# EAGLE design Arduino Nano2 (EAGLE 6.1)
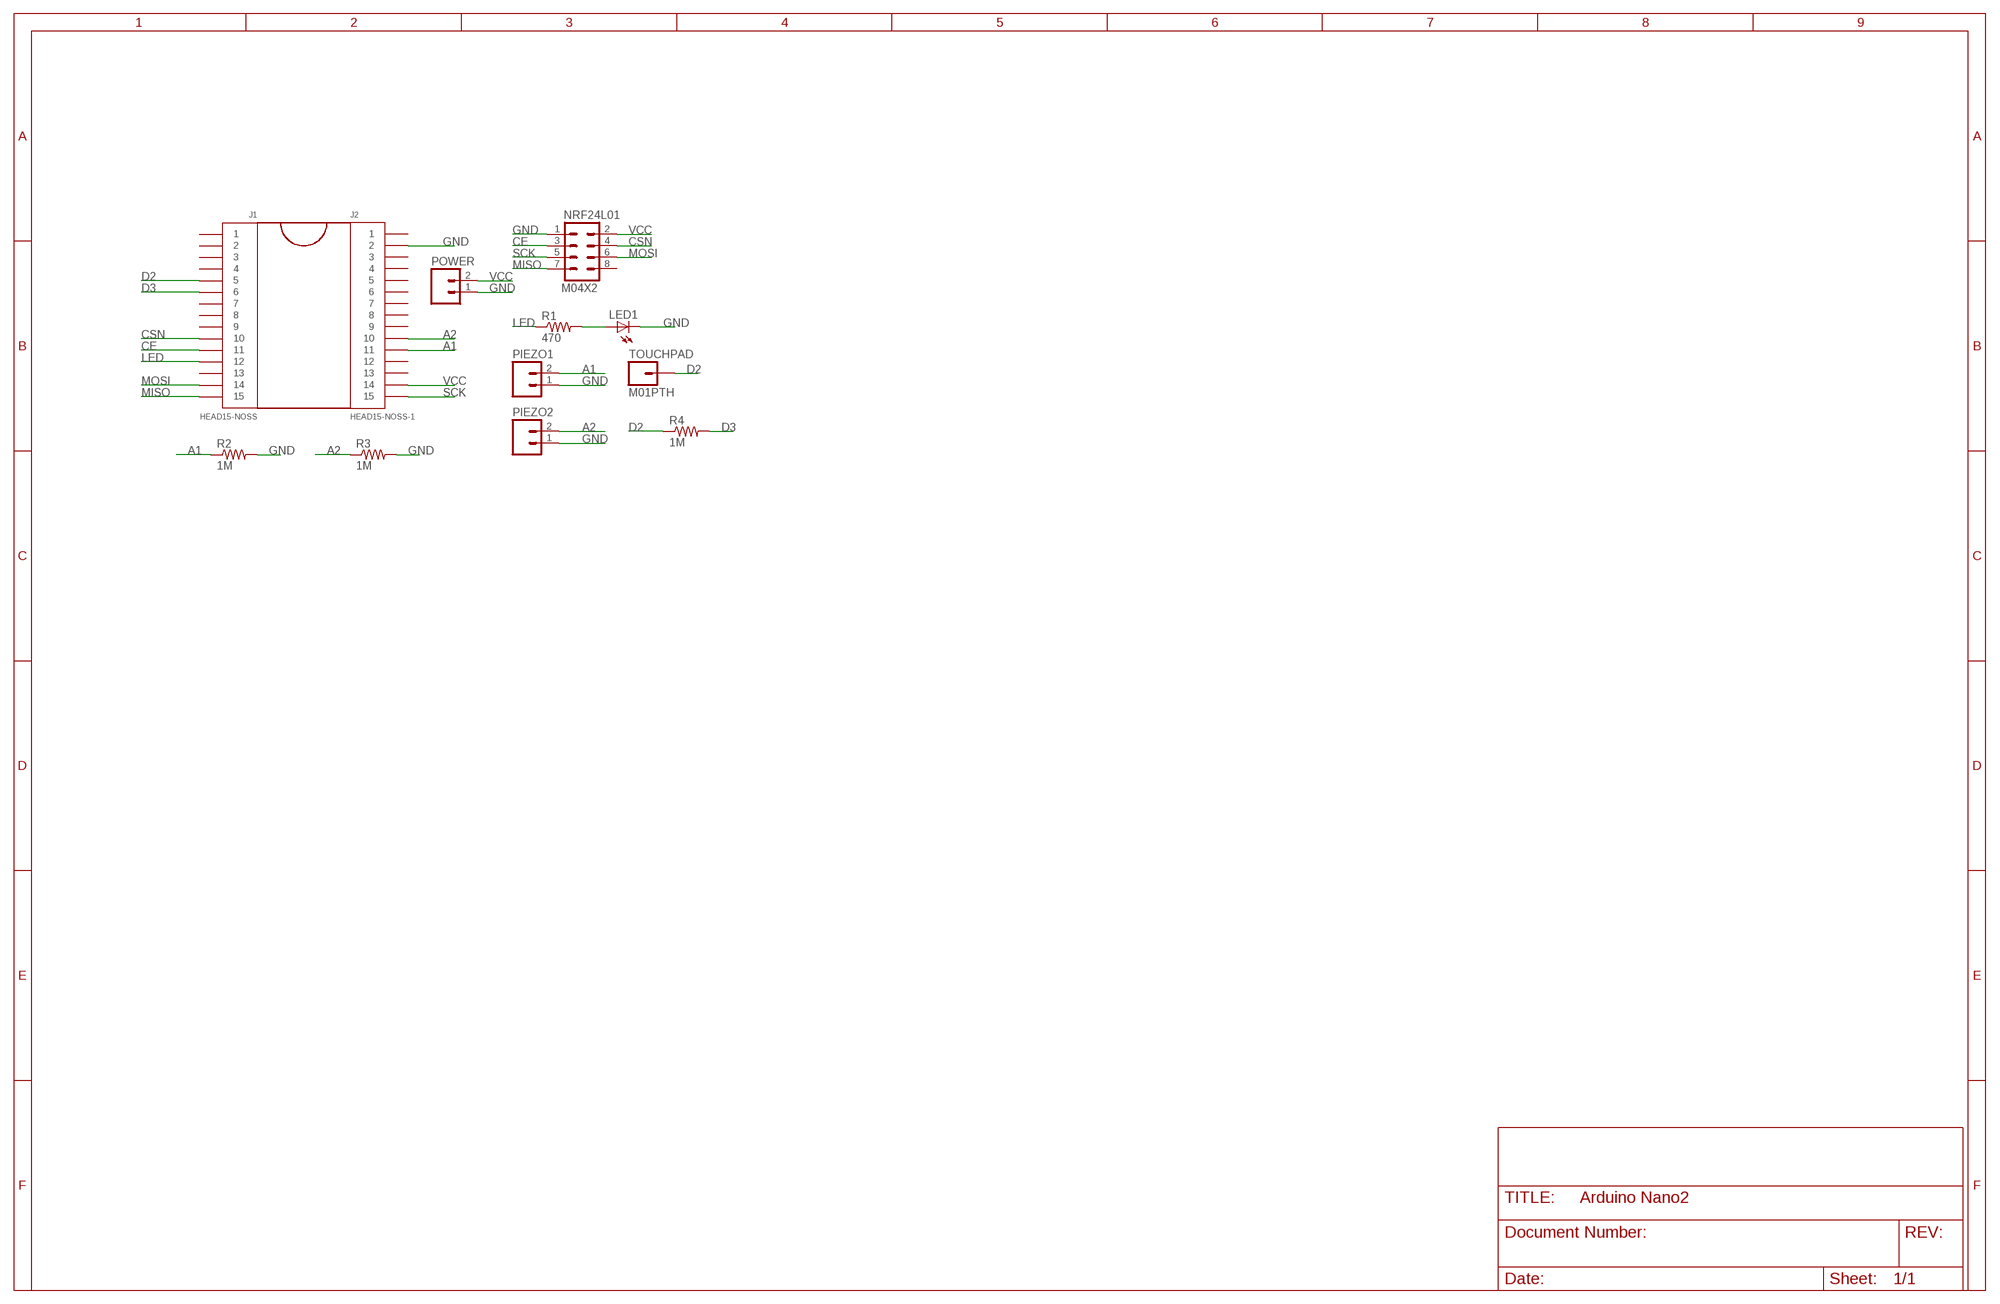
[diagram p0: schematic, sheet 1]

## Parts
J1  HEAD15-NOSS  [HEAD15-NOSS]
J2  HEAD15-NOSS-1  [HEAD15-NOSS-1]
LED1  LED_LED5MM  [LED_LED5MM]
NRF24L01  M04X2  [2X4]
PIEZO1  M02LOCK  [1X02_LOCK]
PIEZO2  M02LOCK  [1X02_LOCK]
POWER  M02LOCK  [1X02_LOCK]
R1  470  RESISTORAXIAL-0.3  [AXIAL-0.3]
R2  1M  RESISTORAXIAL-0.3  [AXIAL-0.3]
R3  1M  RESISTORAXIAL-0.3  [AXIAL-0.3]
R4  1M  RESISTORAXIAL-0.3  [AXIAL-0.3]
TOUCHPAD  M01PTH  [1X01]

## Nets
A1: J2.11 PIEZO1.2 R2.P$1
A2: J2.10 PIEZO2.2 R3.P$1
CE: J1.11 NRF24L01.3
CSN: J1.10 NRF24L01.4
D2: J1.5 R4.P$1 TOUCHPAD.1
D3: J1.6 R4.P$2
GND: J2.2 LED1.K(C) NRF24L01.1 PIEZO1.1 PIEZO2.1 POWER.1 R2.P$2 R3.P$2
LED: J1.12 R1.P$1
MISO: J1.15 NRF24L01.7
MOSI: J1.14 NRF24L01.6
N$2: LED1.A R1.P$2
SCK: J2.15 NRF24L01.5
VCC: J2.14 NRF24L01.2 POWER.2
Unconnected: J1.1 J1.2 J1.3 J1.4 J1.7 J1.8 J1.9 J1.13 J2.1 J2.3 J2.4 J2.5 J2.6 J2.7 J2.8 J2.9 J2.12 J2.13 NRF24L01.8

## Library data of the parts
J1 = MyCON2:HEAD15-NOSS
J2 = MyCON2:HEAD15-NOSS-1
LED1 = BBLeo_v2:LED_LED: LED OSRAM: - CHIPLED LG R971, LG N971, LY N971, LG Q971, LY Q971, LO R971, LY R971 LH N974, LH R974 LS Q976, LO Q976, LY Q976 LO Q996 - Hyper CHIPLED LW Q18S LB Q993, LB Q99A, LB R99A - SideLED LS A670, LO A670, LY A670, LG A670, LP A670 LB A673, LV A673, LT A673, LW A673 LH A674 LY A675 LS A676, LA A676, LO A676, LY A676, LW A676 LS A679, LY A679, LG A679 - Hyper Micro SIDELED® LS Y876, LA Y876, LO Y876, LY Y876 LT Y87S - SmartLED LW L88C, LW L88S LB L89C, LB L89S, LG L890 LS L89K, LO L89K, LY L89K LS L896, LA L896, LO L896, LY L896 - TOPLED LS T670, LO T670, LY T670, LG T670, LP T670 LSG T670, LSP T670, LSY T670, LOP T670, LYG T670 LG T671, LOG T671, LSG T671 LB T673, LV T673, LT T673, LW T673 LH T674 LS T676, LA T676, LO T676, LY T676, LB T676, LH T676, LSB T676, LW T676 LB T67C, LV T67C, LT T67C, LS T67K, LO T67K, LY T67K, LW E67C LS E67B, LA E67B, LO E67B, LY E67B, LB E67C, LV E67C, LT E67C LW T67C LS T679, LY T679, LG T679 LS T770, LO T770, LY T770, LG T770, LP T770 LB T773, LV T773, LT T773, LW T773 LH T774 LS E675, LA E675, LY E675, LS T675 LS T776, LA T776, LO T776, LY T776, LB T776 LHGB T686 LT T68C, LB T68C - Hyper Mini TOPLED® LB M676 - Mini TOPLED Santana® LG M470 LS M47K, LO M47K, LY M47K Source: http://www.osram.convergy.de LUXEON: - LUMILED® LXK2-PW12-R00, LXK2-PW12-S00, LXK2-PW14-U00, LXK2-PW14-V00 LXK2-PM12-R00, LXK2-PM12-S00, LXK2-PM14-U00 LXK2-PE12-Q00, LXK2-PE12-R00, LXK2-PE12-S00, LXK2-PE14-T00, LXK2-PE14-U00 LXK2-PB12-K00, LXK2-PB12-L00, LXK2-PB12-M00, LXK2-PB14-N00, LXK2-PB14-P00, LXK2-PB14-Q00 LXK2-PR12-L00, LXK2-PR12-M00, LXK2-PR14-Q00, LXK2-PR14-R00 LXK2-PD12-Q00, LXK2-PD12-R00, LXK2-PD12-S00 LXK2-PH12-R00, LXK2-PH12-S00 LXK2-PL12-P00, LXK2-PL12-Q00, LXK2-PL12-R00 Source: www.luxeon.com KINGBRIGHT: KA-3528ASYC Source: www.kingbright.com
NRF24L01 = SparkFun:M04X2
PIEZO1 PIEZO2 POWER = ModernDevice:M02: Header 2 Standard 2-pin 0.1" header. Use with straight break away headers (SKU : PRT-00116), right angle break away headers (PRT-00553), swiss pins (PRT-00743), machine pins (PRT-00117), and female headers (PRT-00115). Molex polarized connector foot print use with SKU : PRT-08233 with associated crimp pins and housings.
R1-R4 = SparkFun:RESISTOR: Resistor Basic schematic elements and footprints for 0603, 1206, and PTH resistors.
TOUCHPAD = ModernDevice:M01: Header 1 Standard 1-pin 0.1" header. Use with straight break away headers (SKU : PRT-00116), right angle break away headers (PRT-00553), swiss pins (PRT-00743), machine pins (PRT-00117), and female headers (PRT-00115).

## Board
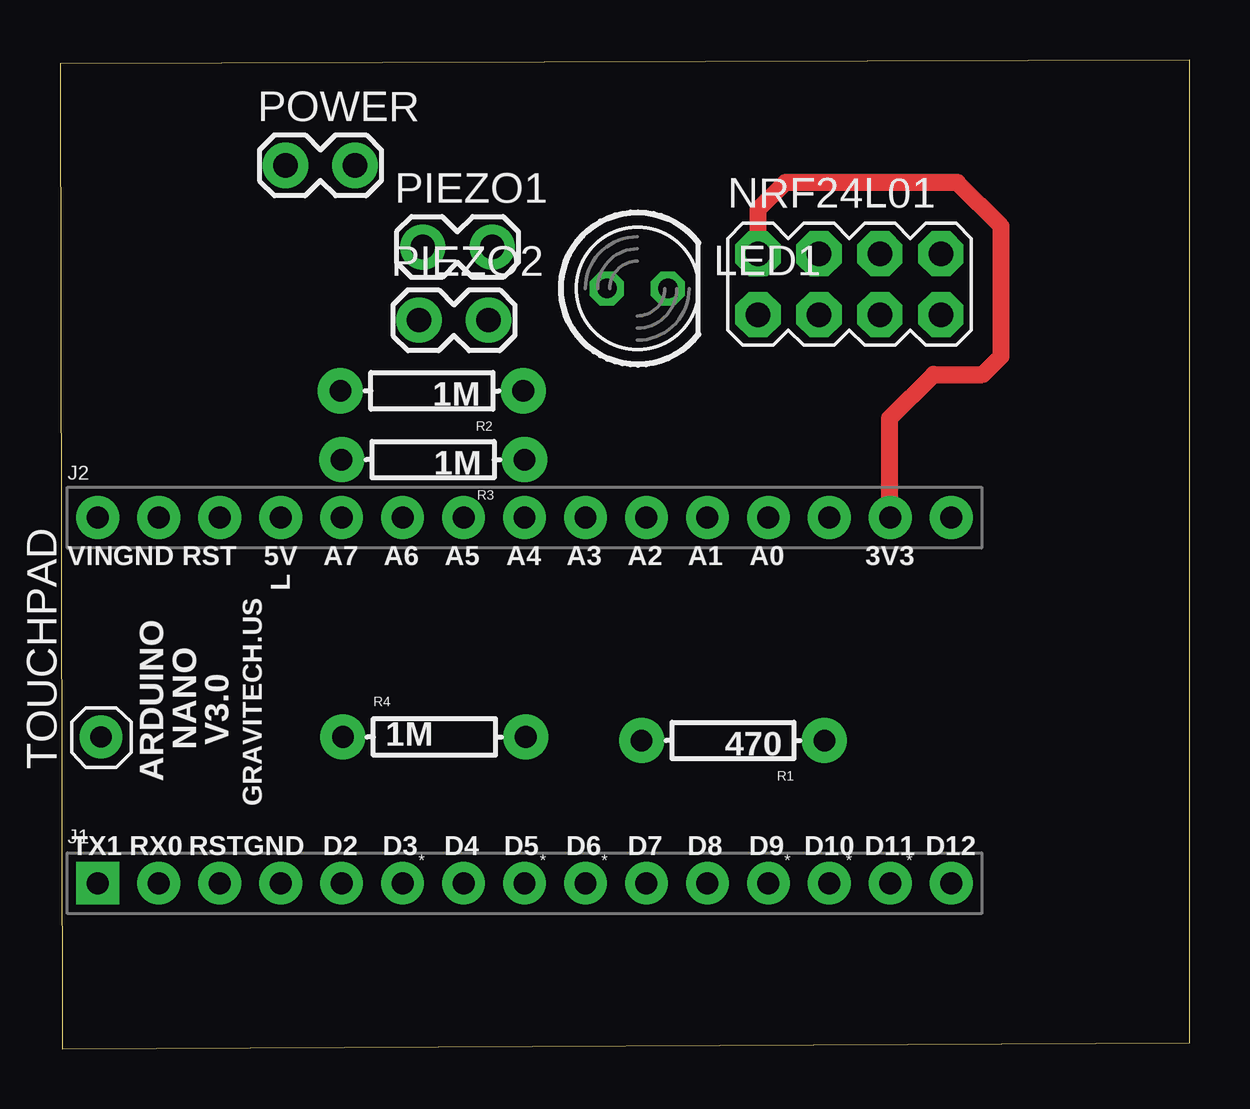
[diagram p1: board, top side]
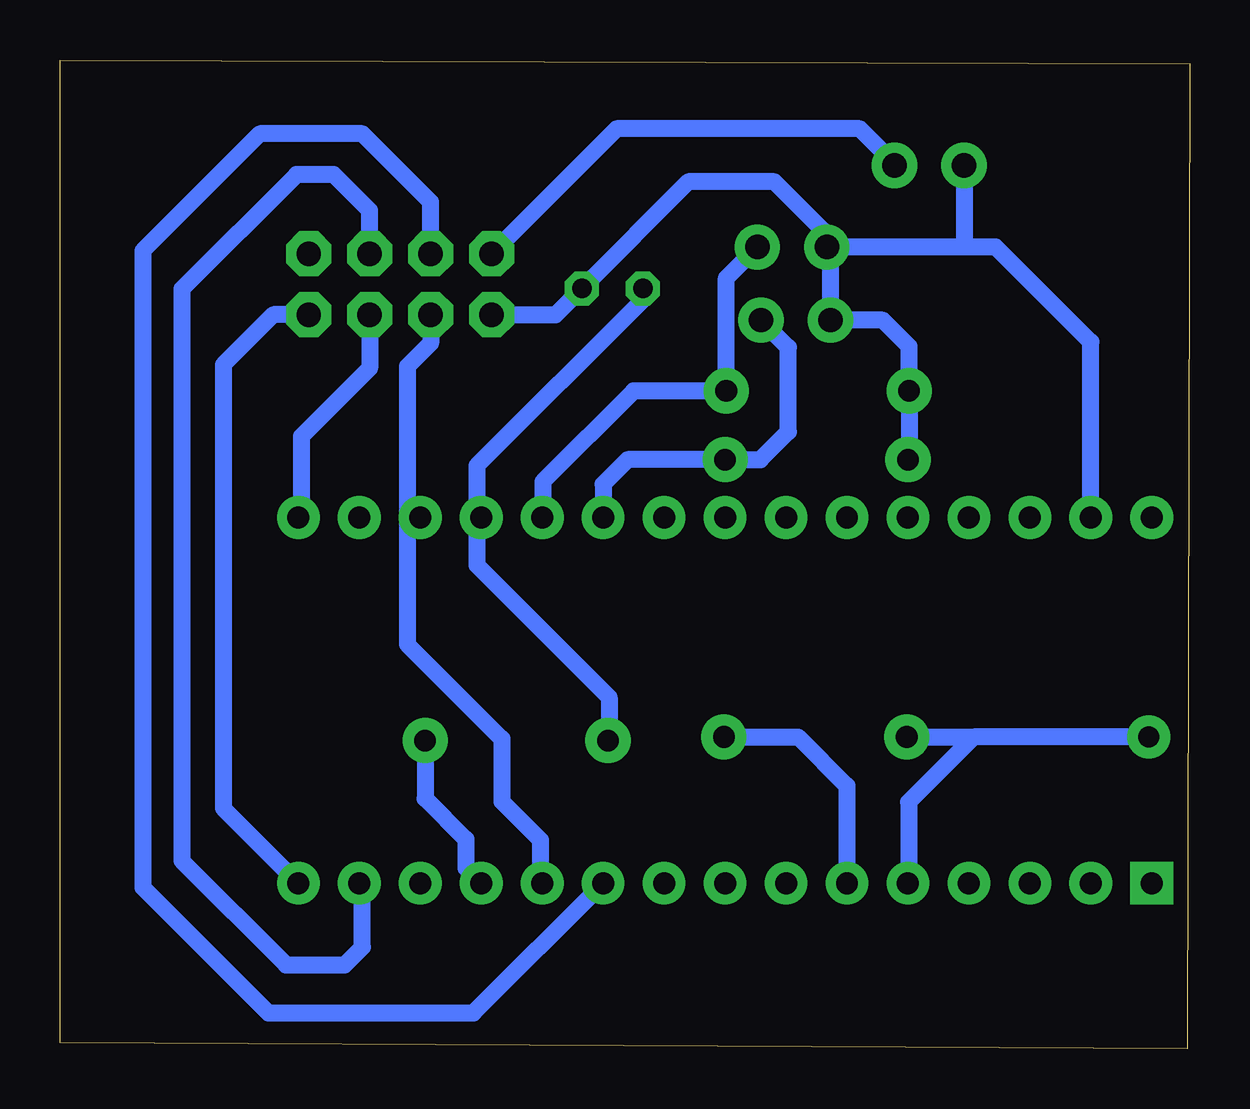
[diagram p2: board, bottom side, seen from below]

Size 47.07 x 41.22 mm. Coordinates in mm from the lower left corner, seen from the top.
Outline: 47.07,0.25 47.07,41.22 0,41.07 0.1,0 47.07,0.25
Copper layers (1*16): Top 0.035mm / dielectric 1.5mm / Bottom 0.035mm
Design rules: minimum track width 8mil, minimum drill 16mil, track to track 8mil, track to pad 8mil, pad to pad 8mil, via to via 8mil, smd to smd 8mil, copper to edge 8mil, drill to drill 8mil, minimum pad ring 12mil, minimum via ring 8mil, stop-mask expansion 4mil, vias tented up to drill 18mil, thermal gap 10mil

### Footprints (pad centres in the part's own frame; a part is rotated, then mirrored left to right if it is on the bottom)
HEAD15-NOSS = drill 0.914 pad 1.778 square: 1 0,0 | drill 0.914 pad 1.778: 2 2.54,0; 3 5.08,0; 4 7.62,0; 5 10.16,0; 6 12.7,0; 7 15.24,0; 8 17.78,0; 9 20.32,0; 10 22.86,0; 11 25.4,0; 12 27.94,0; 13 30.48,0; 14 33.02,0; 15 35.56,0
HEAD15-NOSS-1 = drill 0.914 pad 1.778: 1 0,0; 2 2.54,0; 3 5.08,0; 4 7.62,0; 5 10.16,0; 6 12.7,0; 7 15.24,0; 8 17.78,0; 9 20.32,0; 10 22.86,0; 11 25.4,0; 12 27.94,0; 13 30.48,0; 14 33.02,0; 15 35.56,0
LED_LED5MM = drill 0.813 octagon: A -1.27,0; K 1.27,0
2X4 = drill 1.016 pad 1.88 octagon: 1 -3.81,-1.27; 2 -3.81,1.27; 3 -1.27,-1.27; 4 -1.27,1.27; 5 1.27,-1.27; 6 1.27,1.27; 7 3.81,-1.27; 8 3.81,1.27
1X02_LOCK = drill 1.016 pad 1.88: 1 -0.178,0; 2 2.718,0
AXIAL-0.3 = drill 0.9 pad 1.88: P$1 -3.81,0; P$2 3.81,0
1X01 = drill 0.889 pad 1.778: 1 0,0

### Placement (x,y rotation side)
J1  1.57,6.91 0 top
J2  1.57,22.15 0 top
LED1  24.05,31.7 0 top
NRF24L01  32.89,31.88 0 top
PIEZO1  15.29,33.43 0 top
PIEZO2  15.14,30.38 0 top
POWER  9.58,36.83 0 top
R1  28.04,12.85 180 top
R2  15.49,27.43 180 top
R3  15.54,24.56 180 top
R4  15.6,13 0 top
TOUCHPAD  1.7,13 90 top

### Tracks (layer width: path | path; a pad name or v marks a point on that pad's centre or on a via)
A1
  Bottom 0.406: 26.95,22.17 J2.11
  Bottom 0.7: 26.95,22.17 26.95,23.65 23.16,27.43 R2.P$1 19.3,32.13 PIEZO1.2
A2
  Bottom 0.7: J2.10 24.43,23.55 23.42,24.56 R3.P$1 17.88,24.56 16.71,25.73 16.71,29.24 PIEZO2.2
CE
  Bottom 0.406: 27.05,6.98 J1.11
  Bottom 0.7: NRF24L01.3 31.62,29.41 32.59,28.45 32.59,16.87 28.65,12.93 28.65,10.31 27.05,8.71 27.05,6.98
CSN
  Bottom 0.7: NRF24L01.4 31.62,35.31 34.47,38.15 38.73,38.15 43.61,33.27 43.61,6.73 38.38,1.5 29.84,1.5 J1.10
D2
  Bottom 0.406: 11.71,6.93 J1.5
  Bottom 0.7: TOUCHPAD.1 8.99,13 | 8.99,13 11.71,10.29 11.71,6.93 | R4.P$1 8.99,13
D3
  Bottom 0.7: R4.P$2 16.31,13 14.27,10.97 J1.6
GND
  Bottom 0.406: 14.96,33.27 PIEZO1.1 | 9.4,33.68 9.65,33.43
  Bottom 0.7: NRF24L01.1 26.42,30.61 LED1.K 20.88,36.14 17.3,36.14 15.11,33.96 PIEZO1.1 9.65,33.43 8.08,33.43 4.11,29.46 J2.2 | 14.96,33.27 PIEZO2.1 12.78,30.38 11.68,29.29 R2.P$2 11.68,24.61 R3.P$2 | POWER.1 9.4,33.68
LED
  Bottom 0.7: R1.P$1 31.85,10.44 30.15,8.74 30.15,7.54 J1.12
MISO
  Bottom 0.7: NRF24L01.7 38.18,30.61 40.26,28.52 40.26,10.03 J1.15
MOSI
  Bottom 0.406: 34.47,6.78 J1.14
  Bottom 0.7: NRF24L01.6 34.16,34.95 35.66,36.45 37.21,36.45 41.99,31.67 41.99,7.85 37.64,3.51 35.2,3.51 34.47,4.24 34.47,6.78
N$2
  Bottom 0.7: LED1.A 22.78,31.22 29.69,24.31 29.69,20.17 24.18,14.66 24.18,12.9 R1.P$2
SCK
  Bottom 0.406: 37.01,22.28 J2.15
  Bottom 0.7: NRF24L01.5 34.16,28.37 37.01,25.53 37.01,22.28
VCC
  Top 0.7: J2.14 34.57,22.17 34.57,26.29 36.4,28.12 38.46,28.12 39.22,28.88 39.22,34.29 37.39,36.12 30.23,36.12 29.08,34.98 NRF24L01.2
  Bottom 0.406: POWER.2 12.29,36.91
  Bottom 0.7: 12.29,36.91 13.74,38.35 23.88,38.35 NRF24L01.2

### Text on the board
tPlace: VIN | GND | RST | 5V | A7 | A6 | A5 | A4 | A3 | A2 | A1 | A0 | 3V3 | L | NANO | V3.0 | ARDUINO | GRAVITECH.US | TX1 | RX0 | RST | GND | D2 | D3 | D4 | D5 | D6 | D7 | D8 | D9 | D10 | D11 | D12 | * | * | * | * | * | *